# EAGLE design digitalky2 (EAGLE 6.1)
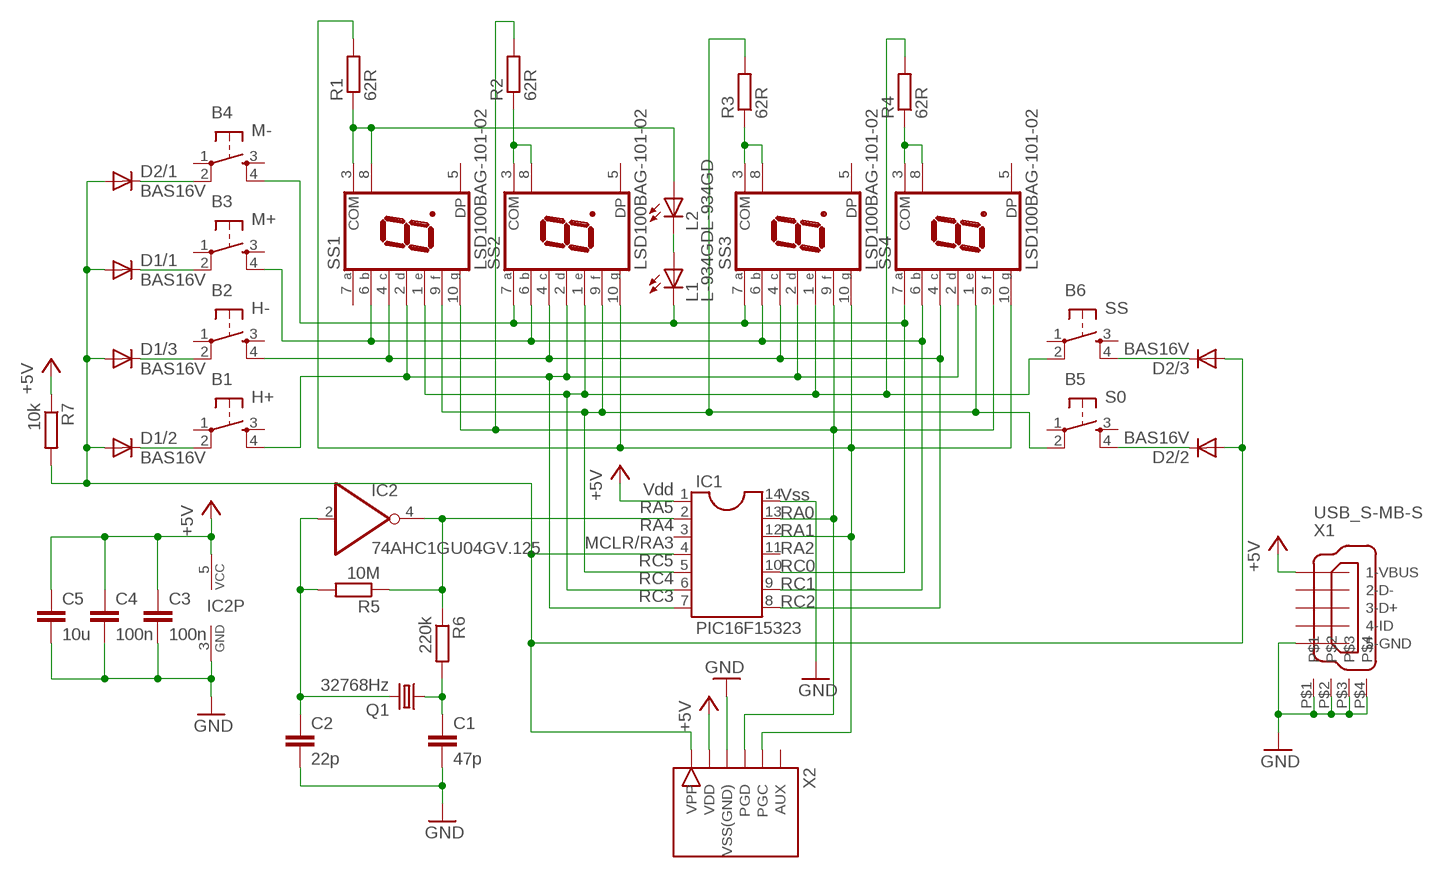
[diagram p0: schematic, sheet 1]

## Parts
B1  H+  TD-03  [TD-03]
B2  H-  TD-03  [TD-03]
B3  M+  TD-03  [TD-03]
B4  M-  TD-03  [TD-03]
B5  S0  TD-03  [TD-03]
B6  SS  TD-03  [TD-03]
C1  47p  C-EUC0805  [C0805]
C2  22p  C-EUC0805  [C0805]
C3  100n  C-EUC0805  [C0805]
C4  100n  C-EUC0805  [C0805]
C5  10u  C-EUC1206  [C1206]
D1  BAS16V  [SOT363]
D2  BAS16V  [SOT363]
IC1  PIC16F15323  DIL14_SMD  [SO-14]
IC2  74AHC1GU04GV.125  74AHC1G04DBV  [SOT23-5]
L1  L-934GD  LED3MM  [LED3MM]
L2  L-934GD  LED3MM  [LED3MM]
Q1  32768Hz  CRYSTALTC38H  [TC38H]
R1  62R  R-EU_R0805  [R0805]
R2  62R  R-EU_R0805  [R0805]
R3  62R  R-EU_R0805  [R0805]
R4  62R  R-EU_R0805  [R0805]
R5  10M  R-EU_R0805  [R0805]
R6  220k  R-EU_R0805  [R0805]
R7  10k  R-EU_R0805  [R0805]
SS1  LSD100BAG-101-02  7-SEG_SA10-21-R  [SA10-21-R]
SS2  LSD100BAG-101-02  7-SEG_SA10-21-R  [SA10-21-R]
SS3  LSD100BAG-101-02  7-SEG_SA10-21-R  [SA10-21-R]
SS4  LSD100BAG-101-02  7-SEG_SA10-21-R  [SA10-21-R]
X1  USB_S-MB-S  [USB-MB-S]
X2  PICKITXS  [6PIN3]

## Nets
+5V: C3.1 C4.1 C5.1 IC1.1 IC2.5(VCC) R7.1 X1.VBUS(1-VBUS) X2.P$2(VDD)
GND: C1.2 C2.2 C3.2 C4.2 C5.2 IC1.14 IC2.3(GND) X1.GND(5-GND) X1.P$1 X1.P$2 X1.P$3 X1.P$4 X2.P$3(VSS(GND))
N$1: B4.4 IC1.10 L1.K(C) SS2.7(A) SS3.7(A) SS4.7(A)
N$2: B3.4 IC1.9 SS1.6(B) SS2.6(B) SS3.6(B) SS4.6(B)
N$3: B2.4 IC1.8 SS1.4(C) SS2.4(C) SS3.4(C) SS4.4(C)
N$4: B1.4 IC1.7 SS1.2(D) SS2.2(D) SS3.2(D) SS4.2(D)
N$5: B6.2 IC1.6 R4.2 SS1.1(E) SS2.1(E) SS3.1(E)
N$6: B6.4 D2.4(/3:C)
N$7: L2.A R1.1 SS1.3(COM) SS1.8(COM)
N$8: B5.2 IC1.5 R3.2 SS1.9(F) SS2.9(F) SS4.1(E)
N$9: L1.A L2.K(C)
N$10: IC1.12 R1.2 SS2.10(G) SS3.10(G) SS4.10(G) X2.P$5(PGC)
N$11: R2.1 SS2.3(COM) SS2.8(COM)
N$12: IC1.2 IC2.4(O) R5.1 R6.1
N$13: C2.1 IC2.2(I) Q1.2 R5.2
N$14: R3.1 SS3.3(COM) SS3.8(COM)
N$15: C1.1 Q1.1 R6.2
N$16: R4.1 SS4.3(COM) SS4.8(COM)
N$17: D1.1(/1:A) D1.2(/2:A) D1.3(/3:A) D2.1(/1:A) D2.2(/2:A) D2.3(/3:A) IC1.4 R7.2 X2.P$1(VPP)
N$18: B4.2 D2.6(/1:C)
N$19: B3.2 D1.6(/1:C)
N$20: B2.2 D1.4(/3:C)
N$21: B1.2 D1.5(/2:C)
N$22: B5.4 D2.5(/2:C)
N$26: IC1.13 R2.2 SS1.10(G) SS3.9(F) SS4.9(F) X2.P$4(PGD)
Unconnected: B1.1 B1.3 B2.1 B2.3 B3.1 B3.3 B4.1 B4.3 B5.1 B5.3 B6.1 B6.3 IC1.3 IC1.11 SS1.5(DP) SS1.7(A) SS2.5(DP) SS3.5(DP) SS4.5(DP) X1.D+(3-D+) X1.D-(2-D-) X1.ID(4-ID) X2.P$6(AUX)

## Notes on the sheet
- Vdd
- RA5 | Vss
- RA4 | RA0
- MCLR/RA3 | RA1
- RC5 | RA2
- RC4 | RC0
- RC3 | RC1
- RC2

## Library data of the parts
B1-B6 = switch-tact:TD-03
C1-C5 = rcl:C-EU: CAPACITOR, European symbol
D1 D2 = jfu_drivers:BAS16V: NXP BAS16VV; BAS16VY
IC1 = ic-package:DIL14: Dual In Line / Socket
IC2 = 74xx-little-de:74*1G04: INVERTER Gate
L1 L2 = led:LED: LED OSRAM: - CHIPLED LG R971, LG N971, LY N971, LG Q971, LY Q971, LO R971, LY R971 LH N974, LH R974 LS Q976, LO Q976, LY Q976 LO Q996 - Hyper CHIPLED LW Q18S LB Q993, LB Q99A, LB R99A - SideLED LS A670, LO A670, LY A670, LG A670, LP A670 LB A673, LV A673, LT A673, LW A673 LH A674 LY A675 LS A676, LA A676, LO A676, LY A676, LW A676 LS A679, LY A679, LG A679 - Hyper Micro SIDELED® LS Y876, LA Y876, LO Y876, LY Y876 LT Y87S - SmartLED LW L88C, LW L88S LB L89C, LB L89S, LG L890 LS L89K, LO L89K, LY L89K LS L896, LA L896, LO L896, LY L896 - TOPLED LS T670, LO T670, LY T670, LG T670, LP T670 LSG T670, LSP T670, LSY T670, LOP T670, LYG T670 LG T671, LOG T671, LSG T671 LB T673, LV T673, LT T673, LW T673 LH T674 LS T676, LA T676, LO T676, LY T676, LB T676, LH T676, LSB T676, LW T676 LB T67C, LV T67C, LT T67C, LS T67K, LO T67K, LY T67K, LW E67C LS E67B, LA E67B, LO E67B, LY E67B, LB E67C, LV E67C, LT E67C LW T67C LS T679, LY T679, LG T679 LS T770, LO T770, LY T770, LG T770, LP T770 LB T773, LV T773, LT T773, LW T773 LH T774 LS E675, LA E675, LY E675, LS T675 LS T776, LA T776, LO T776, LY T776, LB T776 LHGB T686 LT T68C, LB T68C - Hyper Mini TOPLED® LB M676 - Mini TOPLED Santana® LG M470 LS M47K, LO M47K, LY M47K Source: http://www.osram.convergy.de LUXEON: - LUMILED® LXK2-PW12-R00, LXK2-PW12-S00, LXK2-PW14-U00, LXK2-PW14-V00 LXK2-PM12-R00, LXK2-PM12-S00, LXK2-PM14-U00 LXK2-PE12-Q00, LXK2-PE12-R00, LXK2-PE12-S00, LXK2-PE14-T00, LXK2-PE14-U00 LXK2-PB12-K00, LXK2-PB12-L00, LXK2-PB12-M00, LXK2-PB14-N00, LXK2-PB14-P00, LXK2-PB14-Q00 LXK2-PR12-L00, LXK2-PR12-M00, LXK2-PR14-Q00, LXK2-PR14-R00 LXK2-PD12-Q00, LXK2-PD12-R00, LXK2-PD12-S00 LXK2-PH12-R00, LXK2-PH12-S00 LXK2-PL12-P00, LXK2-PL12-Q00, LXK2-PL12-R00 Source: www.luxeon.com KINGBRIGHT: KA-3528ASYC Source: www.kingbright.com
Q1 = crystal:CRYSTAL: CRYSTAL; OC_FARNELL: unknown; OC_NEWARK: unknown
R1-R7 = rcl:R-EU_: RESISTOR, European symbol
SS1-SS4 = display-kingbright:7-SEG_: Kingbright 14.2mm (0.56 INCH) SINGLE DIGIT NUMERIC DUISPLAY Source: SA56-11EWA(Ver1189471036.pdf
X1 = con-usb-3:USB_S: USB Connectors with shield
X2 = jfu_drivers:PICKIT

## Board
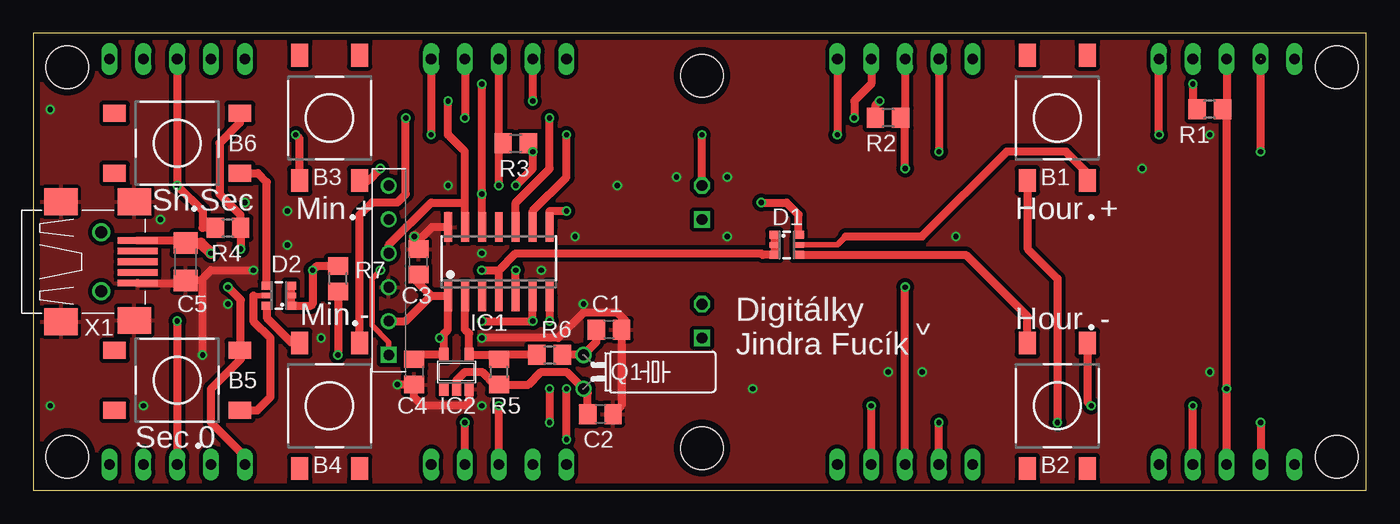
[diagram p1: board, top side]
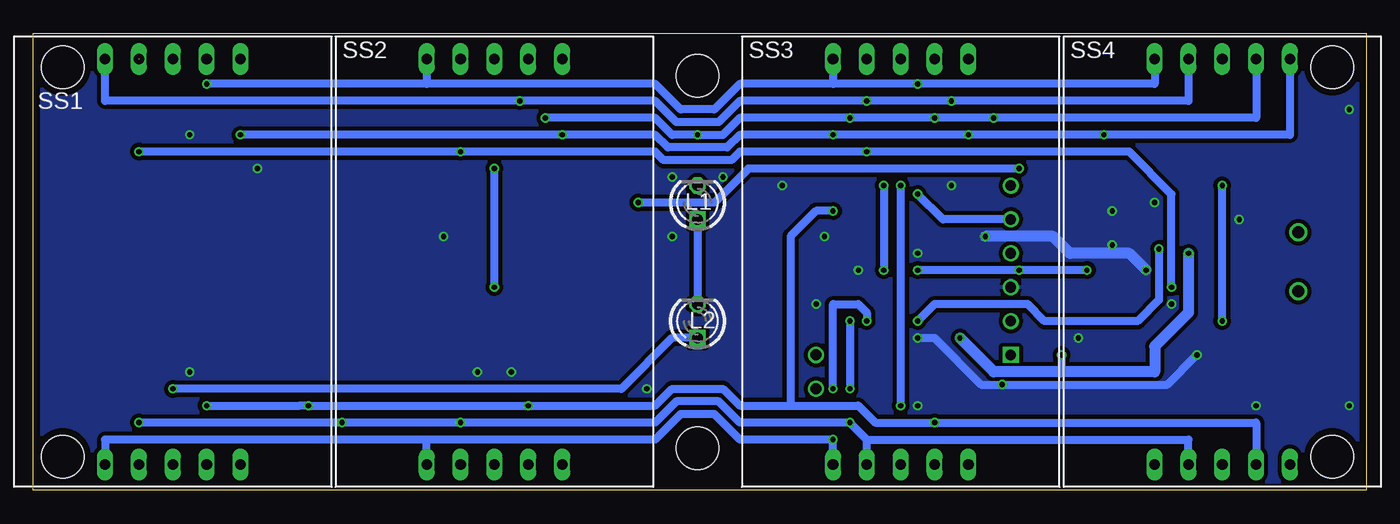
[diagram p2: board, bottom side, seen from below]

Size 100 x 34.28 mm. Coordinates in mm from the lower left corner, seen from the top.
Outline: 0,0 100,0 100,34.28 0,34.28 0,0
Copper layers (1*16): Top 0.035mm / dielectric 1.6mm / Bottom 0.035mm
Design rules: minimum track width 6mil, minimum drill 12mil, track to track 6mil, track to pad 6mil, pad to pad 6mil, via to via 8mil, smd to smd 0mil, copper to edge 20mil, drill to drill 10mil, minimum pad ring 6mil, minimum via ring 6mil, stop-mask expansion 0mil, vias tented up to drill 100mil, thermal gap 10mil
Holes 3.2 mm at 2.54,2.54 2.54,31.75 97.79,31.75 97.79,2.54 50.16,31.11 50.16,3.17

### Footprints (pad centres in the part's own frame; a part is rotated, then mirrored left to right if it is on the bottom)
TD-03 = smd 1.7 x 1.3: 1 -4.7,2.25; 2 4.7,2.25; 3 -4.7,-2.25; 4 4.7,-2.25
C0805 = smd 1.3 x 1.5: 1 -0.95,0; 2 0.95,0
C1206 = smd 1.6 x 1.8: 1 -1.4,0; 2 1.4,0
SOT363 = smd 0.6 x 0.8: 1 -0.75,-0.9; 3 0.75,-0.9; 4 0.75,0.9; 6 -0.75,0.9 | smd 0.4 x 0.8: 2 0,-0.9; 5 0,0.9
SO-14 = smd 0.6 x 2.2: 1 -3.81,-2.6; 2 -2.54,-2.6; 3 -1.27,-2.6; 4 0,-2.6; 5 1.27,-2.6; 6 2.54,-2.6; 7 3.81,-2.6; 8 3.81,2.6; 9 2.54,2.6; 10 1.27,2.6; 11 0,2.6; 12 -1.27,2.6; 13 -2.54,2.6; 14 -3.81,2.6
SOT23-5 = smd 0.69 x 0.99: 1 -0.95,-1.29; 2 0,-1.29; 3 0.95,-1.29; 4 0.95,1.3; 5 -0.95,1.3
LED3MM = drill 0.813 square: A -1.27,0 | drill 0.813 octagon: K 1.27,0
TC38H = drill 0.813: 1 -1.27,0; 2 1.27,0
R0805 = smd 1.3 x 1.5: 1 -0.95,0; 2 0.95,0
SA10-21-R = drill 0.8 long: 1 -5.08,-15.2; 2 -2.54,-15.2; 3 0,-15.2; 4 2.54,-15.2; 5 5.08,-15.2; 6 5.08,15.2; 7 2.54,15.2; 8 0,15.2; 9 -2.54,15.2; 10 -5.08,15.2
USB-MB-S = smd 3 x 0.5: D+ 2.75,0; D- 2.75,0.8; GND 2.75,-1.6; ID 2.75,-0.8; VBUS 2.75,1.6 | smd 2.5 x 2: P$1 -3,-4.5; P$2 -3,4.5; P$3 2.5,-4.4; P$4 2.5,4.5 | drill 0.9 pad 1.016: P$5 0,2.2; P$6 0,-2.2
6PIN3 = drill 0.8 square: P$1 0,6.35 | drill 0.8: P$2 0,3.81; P$3 0,1.27; P$4 0,-1.27; P$5 0,-3.81; P$6 0,-6.35

### Placement (x,y rotation side)
B1  76.83,27.94 270 top
B2  76.83,6.35 90 top
B3  22.23,27.94 270 top
B4  22.23,6.35 90 top
B5  10.79,8.26 0 top
B6  10.79,26.04 0 top
C1  43.18,12.06 0 top
C2  42.55,5.71 0 top
C3  28.89,17.14 90 top
C4  28.57,8.89 270 top
C5  11.43,17.14 270 top
D1  56.52,18.41 270 top
D2  18.41,14.61 90 top
IC1  34.92,17.14 0 top
IC2  31.75,8.89 0 top
L1  50.16,21.59 90 bottom
L2  50.16,12.7 90 bottom
Q1  41.27,8.89 270 top
R1  88.27,28.57 180 top
R2  64.14,27.94 180 top
R3  36.2,26.04 0 top
R4  14.61,19.68 0 top
R5  34.92,8.89 270 top
R6  38.73,10.16 0 top
R7  22.86,15.88 90 top
SS1  89.53,17.14 0 bottom
SS2  65.41,17.14 0 bottom
SS3  34.92,17.14 0 bottom
SS4  10.79,17.14 0 bottom
X1  5.08,17.14 0 top
X2  26.67,16.51 180 top

### Tracks (layer width: path | path; a pad name or v marks a point on that pad's centre or on a via)
+5V  (via drill 0.4)
  Top 0.61: X1.VBUS 11.23,18.75 C5.1 | C4.1 28.93,10.19 IC2.5 30.8,11.75 | 30.8,11.75 31.11,12.06 IC1.1 31.11,14.61 29.84,14.61 | 29.84,14.61 28.57,15.88 C3.1 | v30.48,11.43 30.8,11.75 | R7.1 v22.86,10.16 | X2.P$2 27.94,12.7 29.84,14.61
  Top 0.813: C5.1 12.57,18.55 v13.34,17.78
  Bottom 0.61: v22.86,10.16 22.86,8.89
  Bottom 0.813: v13.34,17.78 13.34,13.34 15.88,10.79 15.88,8.89 22.86,8.89 27.94,8.89 v30.48,11.43
GND  (via drill 0.4)
  Top 0.61: X1.GND 11.23,15.54 C5.2 12.57,15.74 12.7,15.88 | IC1.14 29.91,19.75 28.57,18.41 | 28.57,18.41 C3.2 28.57,17.78 28.57,18.41 | C2.2 44.13,6.35 C1.2 44.13,12.38 44.45,12.7 43.81,13.34 41.27,13.34 39.37,11.43 v33.66,11.43 | IC2.3 32.7,6.67 32.38,6.35 29.21,6.35 28.57,6.99 C4.2 27.62,7.94 v27.3,7.94 | v12.7,10.16 12.7,15.88 | 12.7,15.88 13.34,16.51 v16.51,16.51
  Top 0.813: v28.57,19.05 28.57,18.41
  Bottom 0.61: v33.66,11.43 32.38,11.43 28.89,7.94 v27.3,7.94 14.92,7.94 v12.7,10.16
  Bottom 0.813: v16.51,16.51 17.78,17.78 22.23,17.78 23.5,19.05 v28.57,19.05
  other vias: 31.11,22.86 43.81,22.86 40.64,19.05 41.27,13.97 38.1,16.51 53.98,7.62 33.66,6.35 8.26,6.35 64.14,8.89 66.67,8.89 88.27,8.89 88.27,26.67 83.19,24.13 52.07,23.5 52.07,19.05 1.27,28.57 1.27,6.35 19.05,20.95 15.88,21.59 9.53,20.32 33.66,17.78 69.22,19.05 14.61,13.97 21.59,11.43 19.05,18.41 48.26,23.5
  pour Top (isolate 0.305): -1.27,0 101.6,0 101.6,34.29 -1.27,34.29
  pour Bottom (isolate 0.305): -1.27,0 101.6,0 101.6,34.29 -1.27,34.29
N$1  (via drill 0.4)
  Top 0.61: SS2.7 62.87,30.48 61.59,29.21 v61.59,27.94 | SS3.7 v32.38,27.94 | IC1.10 36.2,21.59 38.73,24.13 v38.73,27.94 | B4.4 24.48,20.66 25.4,21.59 27.3,21.59 27.94,22.23 v27.94,27.94 | L1.K v50.16,26.67
  Bottom 0.61: SS4.7 8.26,27.94 v27.94,27.94 v32.38,27.94 v38.73,27.94 46.99,27.94 48.26,26.67 v50.16,26.67 52.07,26.67 53.34,27.94 v61.59,27.94
N$2  (via drill 0.4)
  Top 0.61: v84.45,26.67 SS1.6 | SS2.6 v60.33,26.67 | IC1.9 37.47,20.95 40.01,23.5 v40.01,26.67 | B3.4 19.98,26.38 v19.68,26.67 | SS3.6 v29.84,26.67
  Bottom 0.61: v84.45,26.67 v60.33,26.67 53.34,26.67 52.39,25.72 47.94,25.72 46.99,26.67 v40.01,26.67 v29.84,26.67 v19.68,26.67 5.71,26.67 SS4.6
N$3  (via drill 0.4)
  Top 0.61: SS3.4 v32.38,5.08 | SS2.4 v62.87,6.35 | SS1.4 v87,6.35 | IC1.8 38.73,20.95 v40.01,20.95 | B2.4 79.08,6.64 v79.38,6.35
  Bottom 0.61: 8.26,1.91 SS4.4 8.26,5.08 v32.38,5.08 36.83,5.08 38.1,6.35 43.18,6.35 | 43.18,6.35 46.99,6.35 48.26,7.62 52.07,7.62 53.34,6.35 v62.87,6.35 v79.38,6.35 80.01,6.35 v87,6.35 | v40.01,20.95 41.27,20.95 43.18,19.05 43.18,6.35
N$4  (via drill 0.4)
  Top 0.61: v92.08,5.08 SS1.2 | SS2.2 v67.94,5.08 | IC1.7 v38.73,12.7 | v38.73,7.62 v38.73,5.08 | B1.4 74.58,18.12 76.83,15.88 v76.83,5.08
  Bottom 0.61: v92.08,5.08 78.11,5.08 v76.83,5.08 v67.94,5.08 53.34,5.08 51.75,6.67 48.58,6.67 46.99,5.08 v38.73,5.08 37.47,3.81 | SS4.2 13.34,3.81 37.47,3.81 | SS3.2 37.47,3.81 | v38.73,12.7 v38.73,7.62
N$5  (via drill 0.4)
  Top 0.61: IC1.6 v37.47,12.7 v33.66,12.7 | v40.01,3.81 v40.01,7.62 | v15.55,18.09 R4.2 15.55,20.64 13.97,22.23 13.97,26.04 15.49,27.56 B6.2
  Bottom 0.61: SS3.1 v40.01,3.81 46.99,3.81 48.9,5.71 51.44,5.71 53.34,3.81 70.48,3.81 | 70.48,3.81 94.61,3.81 SS1.1 | SS2.1 70.48,3.81 | v40.01,7.62 40.01,13.97 38.1,13.97 37.47,13.34 v37.47,12.7 | v33.66,12.7 32.38,13.97 25.4,13.97 24.13,12.7 17.14,12.7 15.55,14.29 v15.55,18.09
N$6
  Top 0.61: B6.4 16.86,23.79 17.52,23.12 D2.4
N$7  (via drill 0.4)
  Top 0.61: SS1.8 89.53,28.89 R1.1 89.53,28.25 v89.53,7.62 SS1.3
  Bottom 0.61: L2.A 52.07,11.43 55.88,7.62 v89.53,7.62
N$8  (via drill 0.4)  (1 unrouted)
  Top 0.61: SS2.9 v67.94,25.4 | SS4.1 15.88,2.54 13.34,5.08 13.34,7.62 15.56,9.84 | R3.2 37.15,25.72 v37.47,25.4 37.47,24.13 v36.2,22.86 | IC1.5 v36.2,16.51 | 15.56,9.84 15.56,14.29 v14.61,15.24 | B5.2 15.49,10.54 15.56,9.84 | v92.08,25.4 92.08,32.38
  Bottom 0.61: v36.2,22.86 v36.2,16.51 | v14.61,15.24 14.61,22.23 17.78,25.4 v37.47,25.4 46.99,25.4 47.62,24.77 52.7,24.77 53.34,25.4 v67.94,25.4 v92.08,25.4
N$9
  Bottom 0.61: L1.A L2.K
N$10  (via drill 0.4)
  Top 0.61: v87,30.48 87,28.57 R1.2 | IC1.12 v33.66,22.23 v33.66,30.48
  Bottom 0.61: SS4.10 15.88,30.48 v33.66,30.48 40.01,30.48 | 40.01,30.48 46.99,30.48 48.9,28.57 51.44,28.57 53.34,30.48 70.48,30.48 | 70.48,30.48 v87,30.48 | SS2.10 70.48,30.48 | SS3.10 40.01,30.48 | X2.P$5 31.75,20.32 v33.66,22.23
N$11  (via drill 0.4)
  Top 0.61: SS2.8 65.41,28.26 R2.1 65.41,27.62 v65.41,24.13 | SS2.3 v65.41,15.24
  Bottom 0.61: v65.41,15.24 v65.41,24.13
N$12
  Top 0.61: R6.1 35.24,10.16 R5.1 34.58,10.19 IC2.4 32.7,11.75 32.38,12.06 IC1.2
N$13
  Top 0.61: IC2.2 31.75,8.26 32.38,8.89 33.66,8.89 34.6,7.94 R5.2 37.15,7.94 38.1,8.89 40.01,8.89 Q1.2 41.59,7.3 C2.1
N$14  (via drill 0.4)
  Top 0.61: SS3.8 34.92,26.67 35.24,26.35 R3.1 34.92,25.71 v34.92,22.86 | SS3.3 v34.92,6.35
  Bottom 0.61: v34.92,6.35 v34.92,22.86
N$15
  Top 0.61: R6.2 Q1.1 42.23,11.12 C1.1
N$16  (via drill 0.4)
  Top 0.61: SS4.8 v10.79,22.86 12.7,20.95 12.7,19.68 R4.1 | v10.79,12.7 SS4.3 10.79,1.91
  Bottom 0.61: v10.79,12.7 v10.79,22.86
N$17  (via drill 0.4)
  Top 0.406: X2.P$1 26.67,11.11 25.4,12.38 25.4,15.88 v26.04,16.51
  Top 0.61: IC1.4 34.92,16.51 | 34.92,16.51 36.2,17.78 54.61,17.78 54.73,17.66 D1.3 D1.2 D1.1 | v33.66,16.51 34.92,16.51 | D2.3 D2.2 D2.1 20.84,13.86 20.95,13.97 v20.95,16.51 21.27,16.82 R7.2
  Bottom 0.61: v20.95,16.51 v26.04,16.51 v33.66,16.51
N$18
  Top 0.61: D2.6 17.52,12.96 19.43,11.05 B4.2
N$19  (via drill 0.4)
  Top 0.61: B3.2 25.14,23.24 v26.04,24.13 | v54.61,21.59 56.52,21.59 57.41,20.69 D1.6
  Bottom 0.61: v26.04,24.13 46.35,24.13 48.9,21.59 v54.61,21.59
N$20
  Top 0.61: D1.4 69.97,17.66 74.58,13.04 B2.2
N$21
  Top 0.406: D1.5 60.33,18.41 60.96,19.05
  Top 0.61: B1.2 79.08,23.79 77.47,25.4 73.03,25.4 66.67,19.05 60.96,19.05
N$22
  Top 0.406: D2.5 16.51,14.61
  Top 0.61: 16.51,14.61 16.51,12.7 17.78,11.43 17.78,6.99 16.8,6 B5.4
N$26  (via drill 0.4)
  Top 0.61: SS3.9 v37.47,29.21 | IC1.13 32.38,21.59 | R2.2 63.19,28.89 v63.5,29.21 | X2.P$4 26.67,18.41 29.84,21.59 32.38,21.59 | 32.38,21.59 32.38,25.4 31.11,26.67 v31.11,29.21
  Bottom 0.61: SS4.9 13.34,29.21 v31.11,29.21 v37.47,29.21 46.99,29.21 48.58,27.62 51.75,27.62 53.34,29.21 v63.5,29.21 94.61,29.21 SS1.10

### Text on the board
tPlace: Sh Sec | Min | + | Hour | + | Digitálky | ^ | Min | - | Hour | - | Jindra Fucík | Sec 0